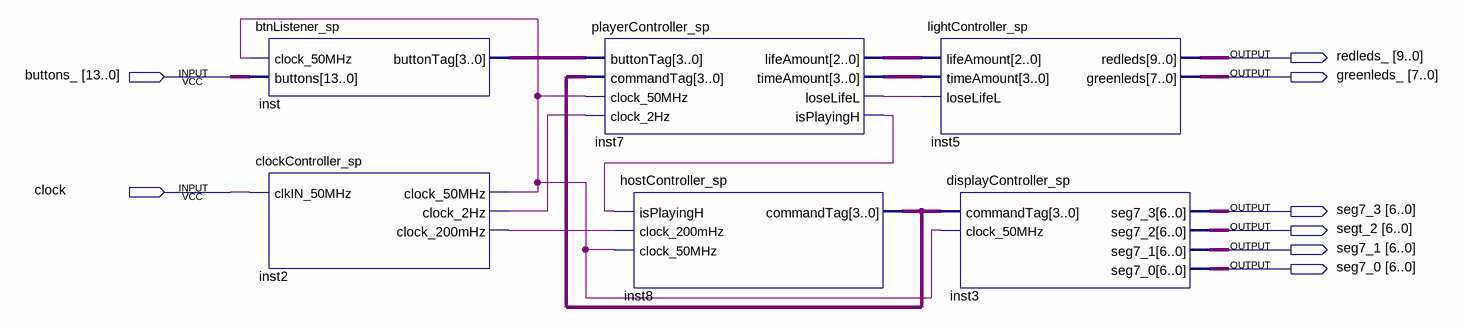
[diagram p0: schematic sheet]
// Quartus schematic main.bdf as structural Verilog: 6 symbols, 8 pins
module main (
  input  [13:0] buttons_,
  input  clock,
  output [9:0] redleds_,
  output [7:0] greenleds_,
  output [6:0] seg7_3,
  output [6:0] segt_2,
  output [6:0] seg7_1,
  output [6:0] seg7_0
);

  wire inst2_clock_2hz, inst2_clock_50mhz, inst2_clock_200mhz, inst7_isplayingh, inst7_loselifel;
  wire [2:0] inst7_lifeamount;
  wire [3:0] inst7_timeamount, inst8_commandtag, inst_buttontag;

  btnListener_sp inst (.clock_50MHz(inst2_clock_50mhz), .buttons(buttons_), .buttonTag(inst_buttontag));
  clockController_sp inst2 (
    .clkIN_50MHz(clock), .clock_50MHz(inst2_clock_50mhz), .clock_2Hz(inst2_clock_2hz),
    .clock_200mHz(inst2_clock_200mhz));
  playerController_sp inst7 (
    .buttonTag(inst_buttontag), .commandTag(inst8_commandtag), .clock_50MHz(inst2_clock_50mhz),
    .clock_2Hz(inst2_clock_2hz), .loseLifeL(inst7_loselifel), .isPlayingH(inst7_isplayingh),
    .lifeAmount(inst7_lifeamount), .timeAmount(inst7_timeamount));
  hostController_sp inst8 (
    .isPlayingH(inst7_isplayingh), .clock_200mHz(inst2_clock_200mhz), .clock_50MHz(inst2_clock_50mhz),
    .commandTag(inst8_commandtag));
  lightController_sp inst5 (
    .lifeAmount(inst7_lifeamount), .timeAmount(inst7_timeamount), .loseLifeL(inst7_loselifel),
    .redleds(redleds_), .greenleds(greenleds_));
  displayController_sp inst3 (
    .commandTag(inst8_commandtag), .clock_50MHz(inst2_clock_50mhz), .seg7_3(seg7_3), .seg7_2(segt_2),
    .seg7_1(seg7_1), .seg7_0(seg7_0));
endmodule
